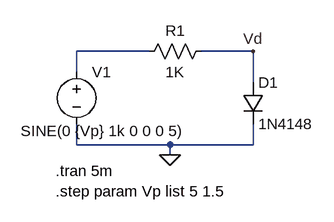
[diagram p0: schematic 3_12_tp2_ej3_pablo_gomez.asc]
3_12_tp2_ej3_pablo_gomez.asc, the LTspice schematic file:
Version 4
SHEET 1 880 680
WIRE 128 128 16 128
WIRE 288 128 208 128
WIRE 16 160 16 128
WIRE 288 176 288 128
WIRE 16 272 16 240
WIRE 160 272 16 272
WIRE 288 272 288 240
WIRE 288 272 160 272
WIRE 160 288 160 272
FLAG 160 288 0
FLAG 288 128 Vd
SYMBOL res 112 144 R270
WINDOW 0 32 56 VTop 2
WINDOW 3 0 56 VBottom 2
SYMATTR InstName R1
SYMATTR Value 1K
SYMBOL diode 272 176 R0
SYMATTR InstName D1
SYMATTR Value 1N4148
SYMBOL voltage 16 144 R0
WINDOW 123 0 0 Left 0
WINDOW 39 0 0 Left 0
WINDOW 3 -86 107 Left 2
SYMATTR Value SINE(0 {Vp} 1k 0 0 0 5)
SYMATTR InstName V1
TEXT -16 312 Left 2 !.tran 5m
TEXT -16 344 Left 2 !.step param Vp list 5 1.5

The netlist it stands for:
* 3_12_tp2_ej3_pablo_gomez.asc
R1 N001 Vd 1K
D1 Vd 0 1N4148
V1 N001 0 SINE(0 {Vp} 1k 0 0 0 5)
.model D D
.lib standard.dio
.tran 5m
.step param Vp list 5 1.5
.backanno
.end